# Altium schematic sheet CSR8645.SchDoc
size A3; Organization: Altium Limited; Address1: L3, 12a Rodborough Rd; Address2: Frenchs Forest; Address3: NSW; Address4: Australia 2086
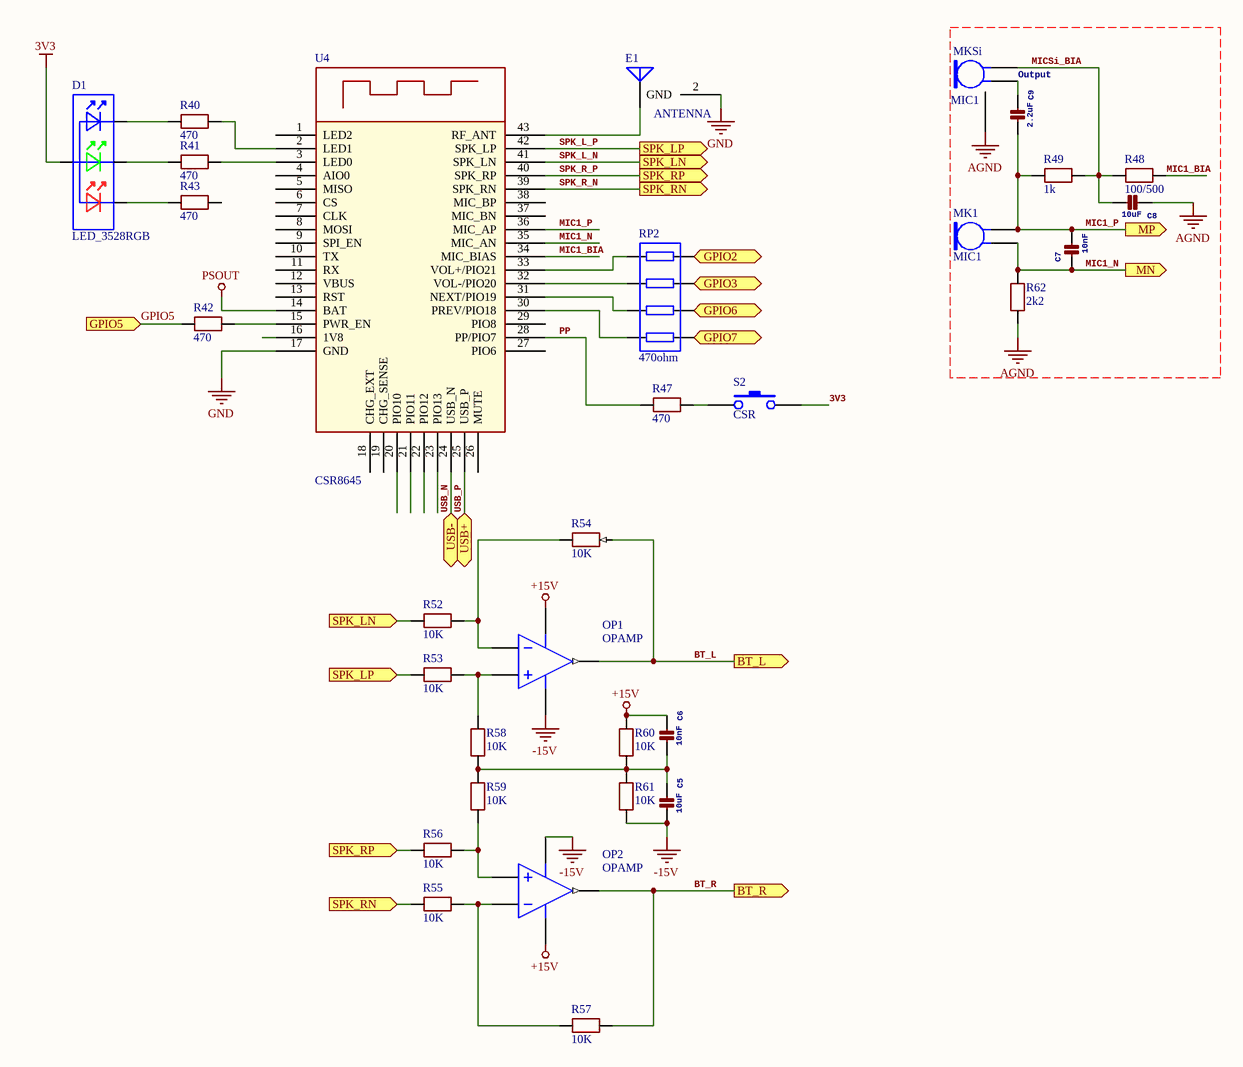
[diagram p0: CSR8645.SchDoc]

## Parts
C5  10uF  [RB3/7MM]
C6  10nF  [WIMA-MKS2C031001A00]
C7  10nF  [0201]
C8  10uF  [0201]
C9  2.2uF  [0201]
D1  LED_3528RGB  [1204_RGB]
E1  ANTENNA  [SMA_FR]
MK1  MIC1  [LED-F3]
MKSi  MIC1  [ADMP504]
OP1  OPAMP  [DIP-8]
OP2  OPAMP  [DIP-8]
R40  470  [0603AR]
R41  470  [0603AR]
R42  470  [0603AR]
R43  470  [0603AR]
R47  470  [0603AR]
R48  100/500  [0402]
R49  1k  [0402]
R52  10K  [MELF-R3216-1206]
R53  10K  [MELF-R3216-1206]
R54  10K  [MELF-R3216-1206]
R55  10K  [MELF-R3216-1206]
R56  10K  [MELF-R3216-1206]
R57  10K  [MELF-R3216-1206]
R58  10K  [MELF-R3216-1206]
R59  10K  [MELF-R3216-1206]
R60  10K  [MELF-R3216-1206]
R61  10K  [MELF-R3216-1206]
R62  2k2  [0402]
RP2  470ohm  [RN8]
S2  CSR  [sw_side]
U4  CSR8645  [CSR8645]

## Ports
BT_L (out), BT_R (out), GPIO2 (bidir), GPIO3 (bidir), GPIO5 (in), GPIO6 (bidir), GPIO7 (bidir), MN (out), MP (out), SPK_LN (in), SPK_LN (out), SPK_LP (in), SPK_LP (out), SPK_RN (in), SPK_RN (out), SPK_RP (in), SPK_RP (out), USB+ (bidir), USB- (bidir)

## Nets
3V3: D1.1(+) S2.1
+15V: C6.1 OP1.7(V+) OP2.7(V+) R60.1
-15V: C5.2 OP1.4(V-) OP2.4(V-) R61.2
AGND: C8.1 MKSi.2(GND) R62.2
GND: E1.2(GND) U4.17(GND)
PSOUT: U4.14(BAT)
BT_L: OP1.6(OUT) R54.1 ; port BT_L
BT_R: OP2.6(OUT) R57.1 ; port BT_R
GPIO2: RP2.8 ; port GPIO2
GPIO3: RP2.7 ; port GPIO3
GPIO5: R42.2 ; port GPIO5
GPIO6: RP2.6 ; port GPIO6
GPIO7: RP2.5 ; port GPIO7
MIC1_BIA: R48.2 U4.34(MIC_BIAS)
MIC1_N: C7.2 MK1.1 R62.1 U4.35(MIC_AN) ; port MN
MIC1_P: C7.1 C9.2 MK1.2 R49.2 U4.36(MIC_AP) ; port MP
MICSi_BIA: C8.2 MKSi.3(VDD) R48.1 R49.1
PP: R47.2 U4.28(PP/PIO7)
SPK_L_N: R52.2 U4.41(SPK_LN) ; port SPK_LN
SPK_L_P: R53.2 U4.42(SPK_LP) ; port SPK_LP
SPK_R_N: R55.2 U4.39(SPK_RN) ; port SPK_RN
SPK_R_P: R56.2 U4.40(SPK_RP) ; port SPK_RP
USB_N: U4.24(USB_N) ; port USB-
USB_P: U4.25(USB_P) ; port USB+
NetC5_1: C5.1 C6.2 R58.2 R59.1 R60.2 R61.1
NetC9_1: C9.1 MKSi.1(OUTPUT)
NetD1_2: D1.2(R-) R43.2
NetD1_3: D1.3(G-) R41.2
NetD1_4: D1.4(B-) R40.2
NetE1_1: E1.1(A) U4.43(RF_ANT)
NetOP1_2: OP1.2(IN-) R52.1 R54.2
NetOP1_3: OP1.3(IN+) R53.1 R58.1
NetOP2_2: OP2.2(IN-) R55.1 R57.2
NetOP2_3: OP2.3(IN+) R56.1 R59.2
NetR40_1: R40.1 U4.2(LED1)
NetR41_1: R41.1 U4.3(LED0)
NetR42_1: R42.1 U4.15(PWR_EN)
NetR47_1: R47.1 S2.2
NetRP2_1: RP2.1 U4.33(VOL+/PIO21)
NetRP2_2: RP2.2 U4.32(VOL-/PIO20)
NetRP2_3: RP2.3 U4.31(NEXT/PIO19)
NetRP2_4: RP2.4 U4.30(PREV/PIO18)

Not connected (* = marked no-connect by the designer): R43 1; U4 1(LED2) 4(AIO0) 5(MISO) 6(CS) 7(CLK) 8(MOSI) 9(SPI_EN) 10(TX) 11(RX) 12(VBUS) 13(RST) 16(1V8) 18(CHG_EXT) 19(CHG_SENSE) 20(PIO10) 21(PIO11) 22(PIO12) 23(PIO13) 26(MUTE) 27(PIO6) 29(PIO8) 37(MIC_BN) 38(MIC_BP)

## Notes on the sheet
- Output
- Title
- Size:
- Date:
- A3
- Number:
- Time:
- Revision:
- Sheet
- of
- File:

## Library data of the parts
C5-C9 = CAP: Ceramic CapacitorsFor new designs, use the packages preceded by an '_' character since they are more reliable:The following footprints should be used on most boards:For extremely tight-pitch boards where space is at a premium, the following 'micro-pitch' footprints can be used (smaller pads, no silkscreen outline, etc.):; GateName_1: G$1; DeviceName: 0603-NOOUTLINE; DeviceSetName: CAP_CERAMIC; SymbolName_1: CAPACITOR; LibraryName: microbuilder
D1 = LED_3528RGB: LED-3528RGB
E1 = ANTENNA: Generic Antenna
MK1 MKSi = MICROPHONE2: Microphone
OP1 OP2 = OPAMP: Operational Amplifier
R40-R43 R47-R49 R52-R62 = RES2: Resistor
RP2 = RESPACK4A: Resistor Network
S2 = SW-PB
U4 = CSR8645: Bluetooth Audio